# EAGLE schematic adder (EAGLE 9.2.0)
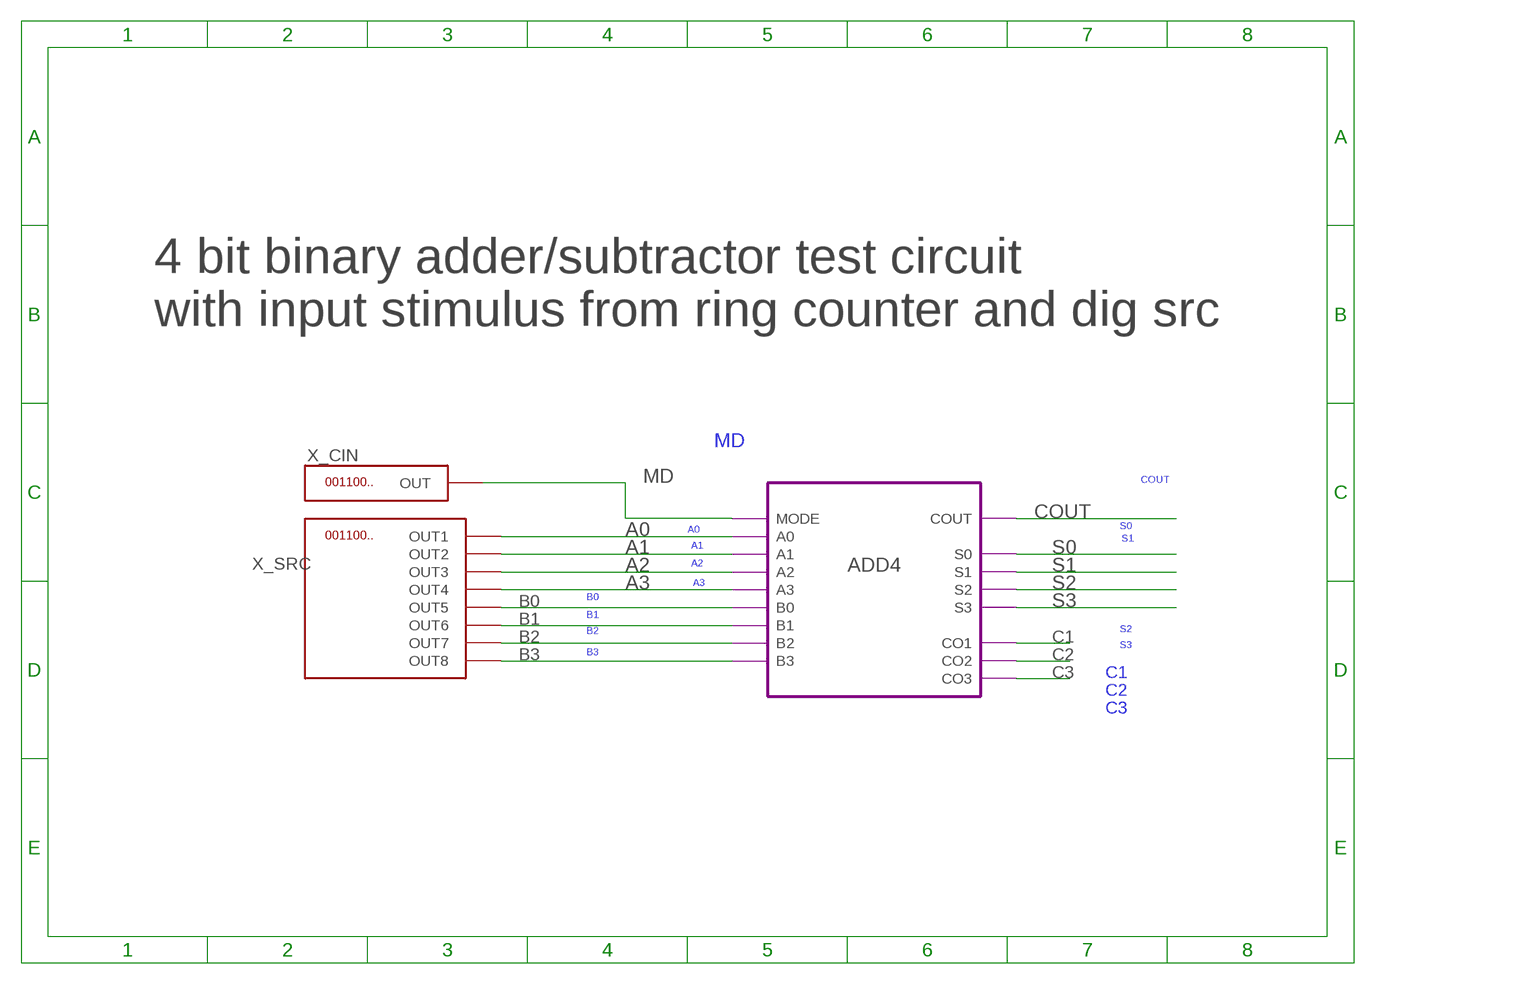
[diagram p0: schematic, sheet 1]

## Parts
X_CIN  DIGSRC  (no package)
X_SRC  DIGSRC8  (no package)

## Module instances
ADD4 = ADDER4BIT

## Nets
A0: X_SRC.OUT1 ; port ADD4.A0
A1: X_SRC.OUT2 ; port ADD4.A1
A2: X_SRC.OUT3 ; port ADD4.A2
A3: X_SRC.OUT4 ; port ADD4.A3
B0: X_SRC.OUT5 ; port ADD4.B0
B1: X_SRC.OUT6 ; port ADD4.B1
B2: X_SRC.OUT7 ; port ADD4.B2
B3: X_SRC.OUT8 ; port ADD4.B3
C1: port ADD4.CO1
C2: port ADD4.CO2
C3: port ADD4.CO3
COUT: port ADD4.COUT
MD: X_CIN.OUT ; port ADD4.MODE
S0: port ADD4.S0
S1: port ADD4.S1
S2: port ADD4.S2
S3: port ADD4.S3

## Notes on the sheet
- 4 bit binary adder/subtractor test circuit 
  with input stimulus from ring counter and dig src

## Library data of the parts
X_CIN = ngspice-digital:DIGSRC: 1 output digital (file) source; EAGLE_DIGITAL_SOURCE_FILE: driverd1_1.dsource.txt; SPICEMODEL: DRIVERD1_1; SPICEPREFIX: X
X_SRC = ngspice-digital:DIGSRC8: 8 output digital (file) source; EAGLE_DIGITAL_SOURCE_FILE: driverd8_1.dsource.txt; SPICEMODEL: DRIVERD8_1; SPICEPREFIX: X

## Module ADDER1BIT
Ports: A(io) B(io) CIN(io) COUT(io) S(io)
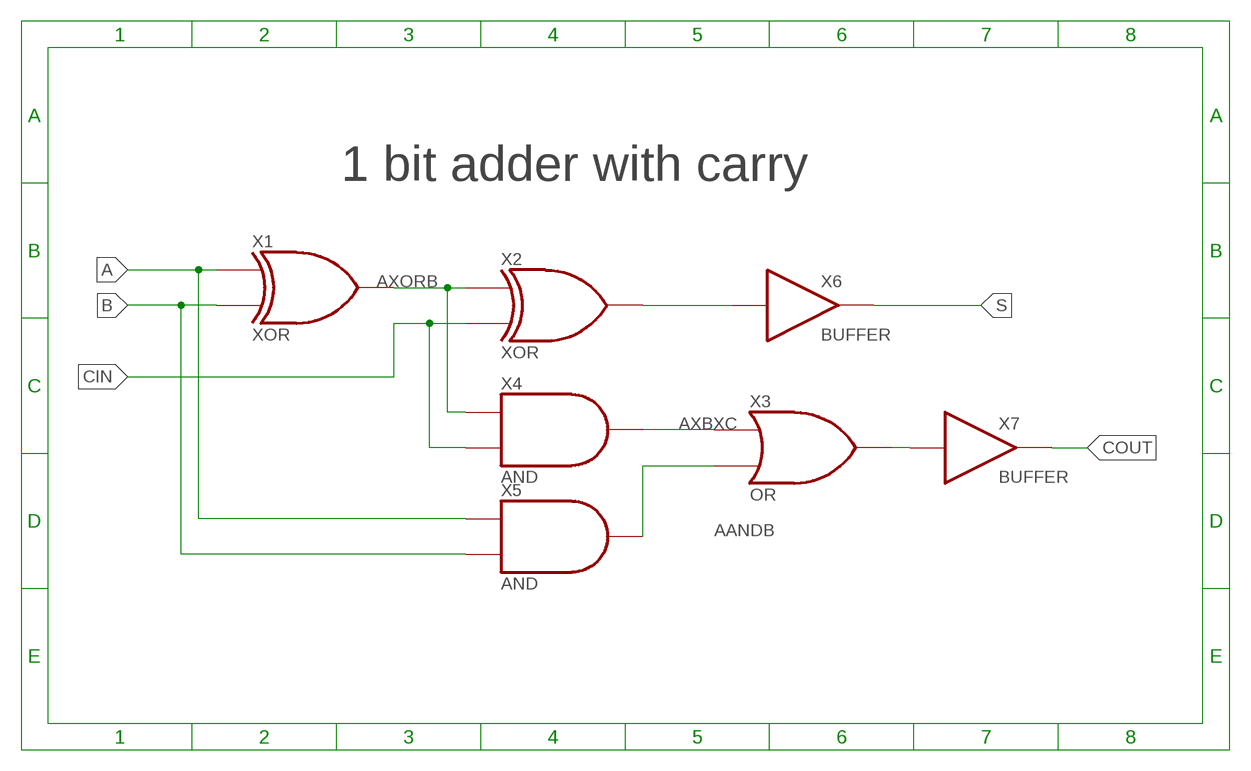
[diagram p1: schematic, module ADDER1BIT, sheet 1]

### Parts
X1  XOR  (no package)
X2  XOR  (no package)
X3  OR  (no package)
X4  AND  (no package)
X5  AND  (no package)
X6  BUFFER  (no package)
X7  BUFFER  (no package)

### Nets
A: X1.A X5.A
AANDB: X3.B X5.Y
AXBXC: X3.A X4.Y
AXORB: X1.Y X2.A X4.A
B: X1.B X5.B
CIN: X2.B X4.B
COUT: X7.O
N$1: X2.Y X6.I
N$2: X3.Y X7.I
S: X6.O

### Notes on the sheet
- 1 bit adder with carry

### Library data of the parts
X1 X2 = ngspice-digital:XOR: 2 input XOR gate
X3 = ngspice-digital:OR: 2 input logic OR gate
X4 X5 = ngspice-digital:AND: 2 input logic AND gate
X6 X7 = ngspice-digital:BUFFER: buffer

## Module ADDER4BIT
Ports: A0(io) A1(io) A2(io) A3(io) B0(io) B2(io) B1(io) B3(io) COUT(io) S0(io) S1(io) S2(io) S3(io) CO1(io) CO2(io) CO3(io) MODE(io)
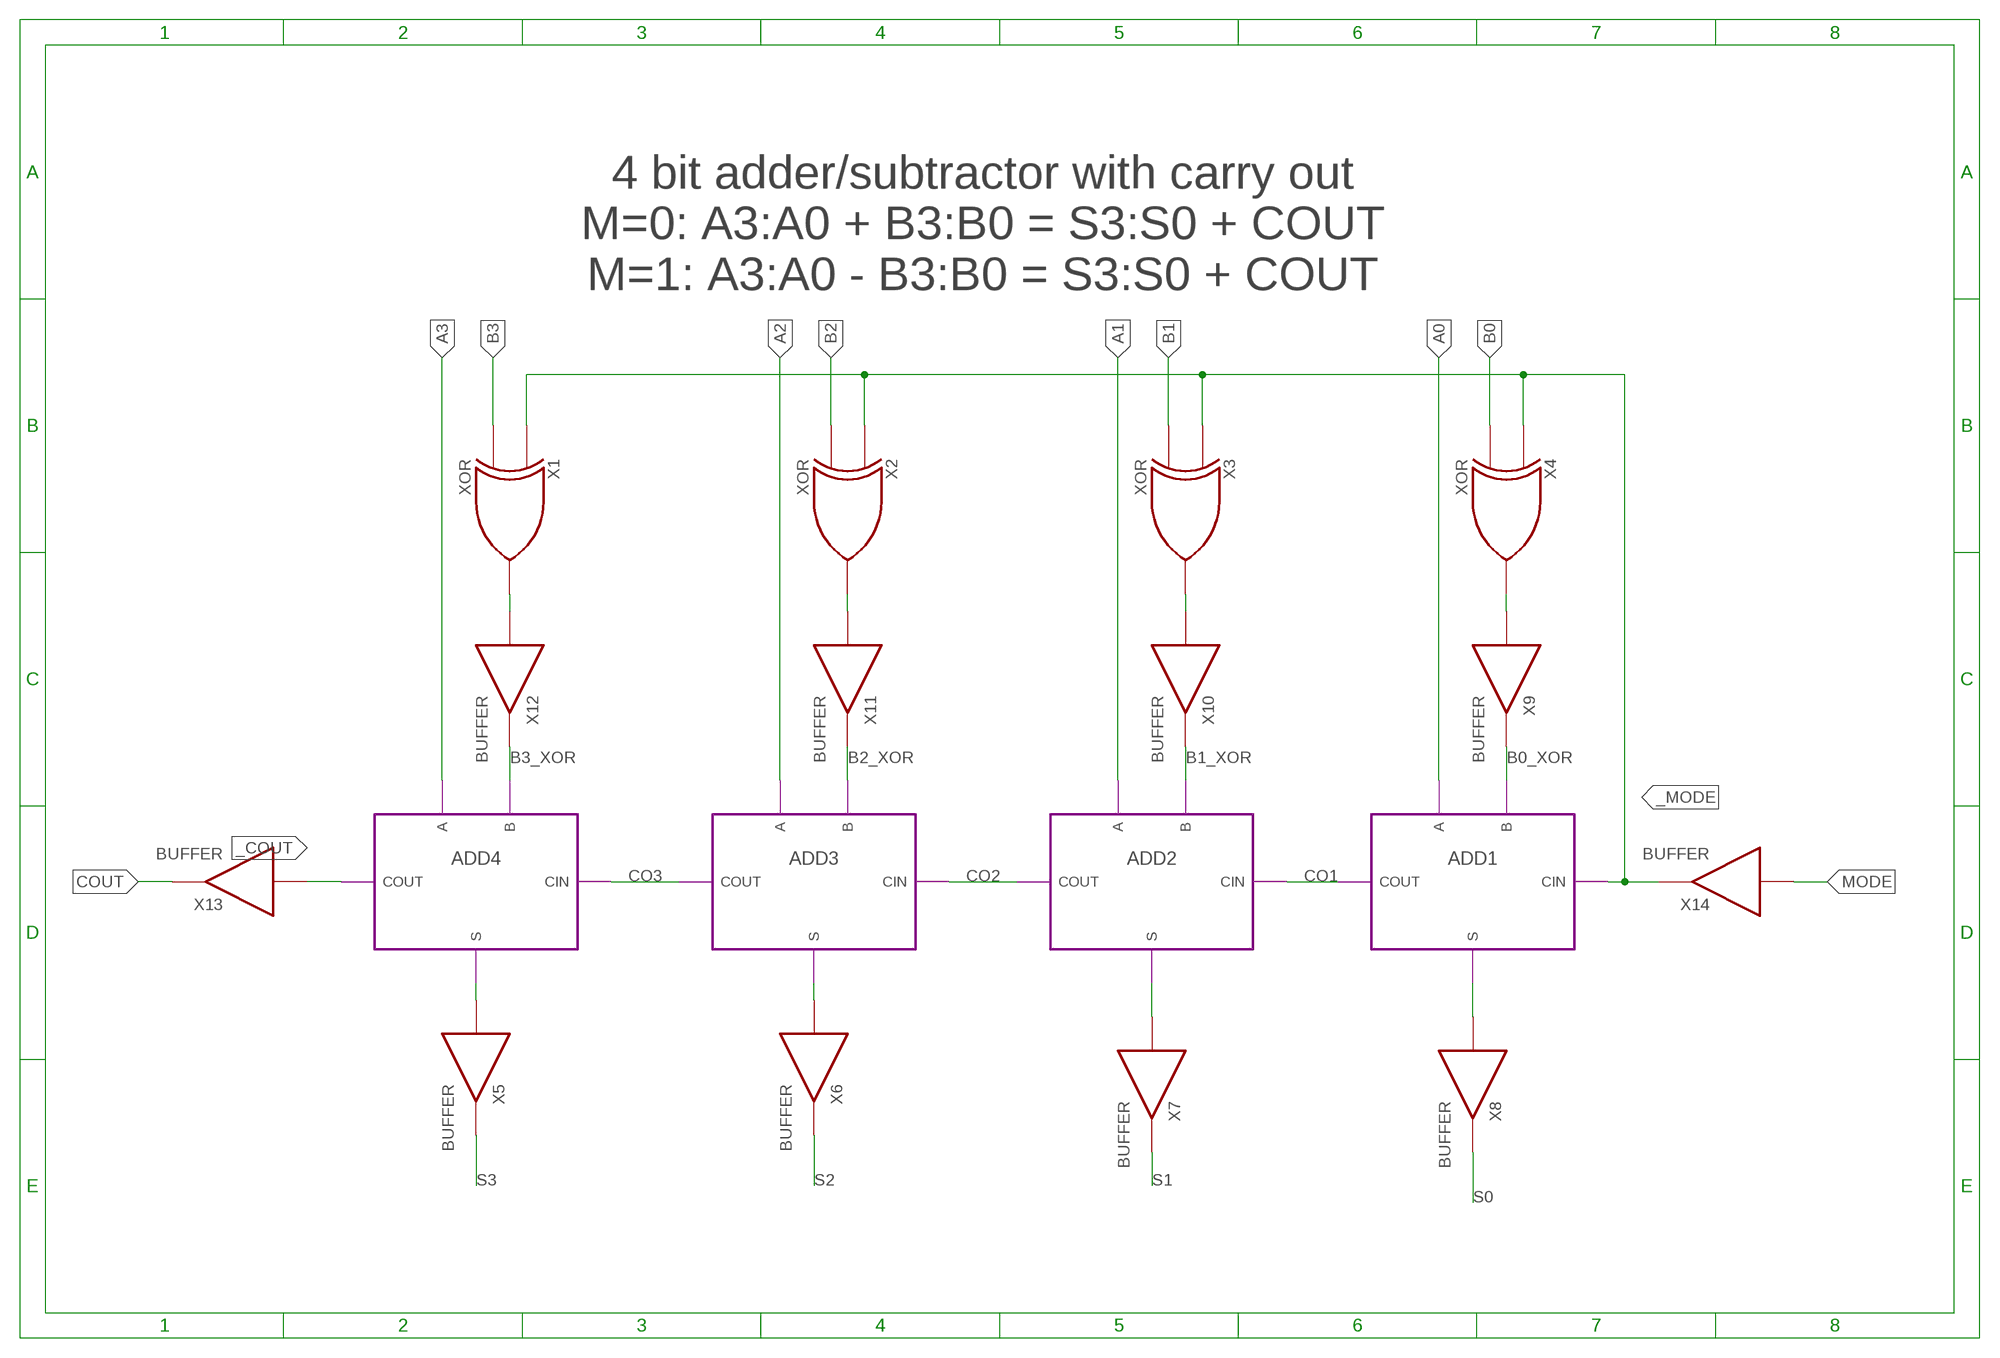
[diagram p2: schematic, module ADDER4BIT, sheet 1]

### Parts
X1  XOR  (no package)
X2  XOR  (no package)
X3  XOR  (no package)
X4  XOR  (no package)
X5  BUFFER  (no package)
X6  BUFFER  (no package)
X7  BUFFER  (no package)
X8  BUFFER  (no package)
X9  BUFFER  (no package)
X10  BUFFER  (no package)
X11  BUFFER  (no package)
X12  BUFFER  (no package)
X13  BUFFER  (no package)
X14  BUFFER  (no package)

### Module instances
ADD3 = ADDER1BIT
ADD2 = ADDER1BIT
ADD1 = ADDER1BIT
ADD4 = ADDER1BIT

### Nets
_COUT: X13.I ; port ADD4.COUT
_MODE: X1.A X2.A X3.A X4.A X14.O ; port ADD1.CIN
A0: port ADD1.A
A1: port ADD2.A
A2: port ADD3.A
A3: port ADD4.A
B0: X4.B
B0_XOR: X9.O ; port ADD1.B
B1: X3.B
B1_XOR: X10.O ; port ADD2.B
B2: X2.B
B2_XOR: X11.O ; port ADD3.B
B3: X1.B
B3_XOR: X12.O ; port ADD4.B
CO1: port ADD2.CIN ADD1.COUT
CO2: port ADD3.CIN ADD2.COUT
CO3: port ADD4.CIN ADD3.COUT
COUT: X13.O
MODE: X14.I
N$1: X5.I ; port ADD4.S
N$2: X6.I ; port ADD3.S
N$3: X7.I ; port ADD2.S
N$4: X8.I ; port ADD1.S
N$5: X4.Y X9.I
N$6: X3.Y X10.I
N$7: X2.Y X11.I
N$8: X1.Y X12.I
S0: X8.O
S1: X7.O
S2: X6.O
S3: X5.O

### Notes on the sheet
- 4 bit adder/subtractor with carry out
  M=0: A3:A0 + B3:B0 = S3:S0 + COUT
  M=1: A3:A0 - B3:B0 = S3:S0 + COUT

### Library data of the parts
X1-X4 = ngspice-digital:XOR: 2 input XOR gate
X5-X14 = ngspice-digital:BUFFER: buffer